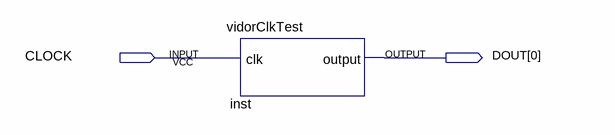
[diagram p0: schematic sheet]
// Quartus schematic vidor_clock.bdf as structural Verilog: 1 symbols, 2 pins
module vidor_clock (
  input  CLOCK,
  output [0:0] DOUT
);

  vidorClkTest inst (.clk(CLOCK), .\output (DOUT[0]));
endmodule
